# Altium schematic sheet ADS131A04.SchDoc
size A4; SheetNumber: 3; SheetTotal: 3
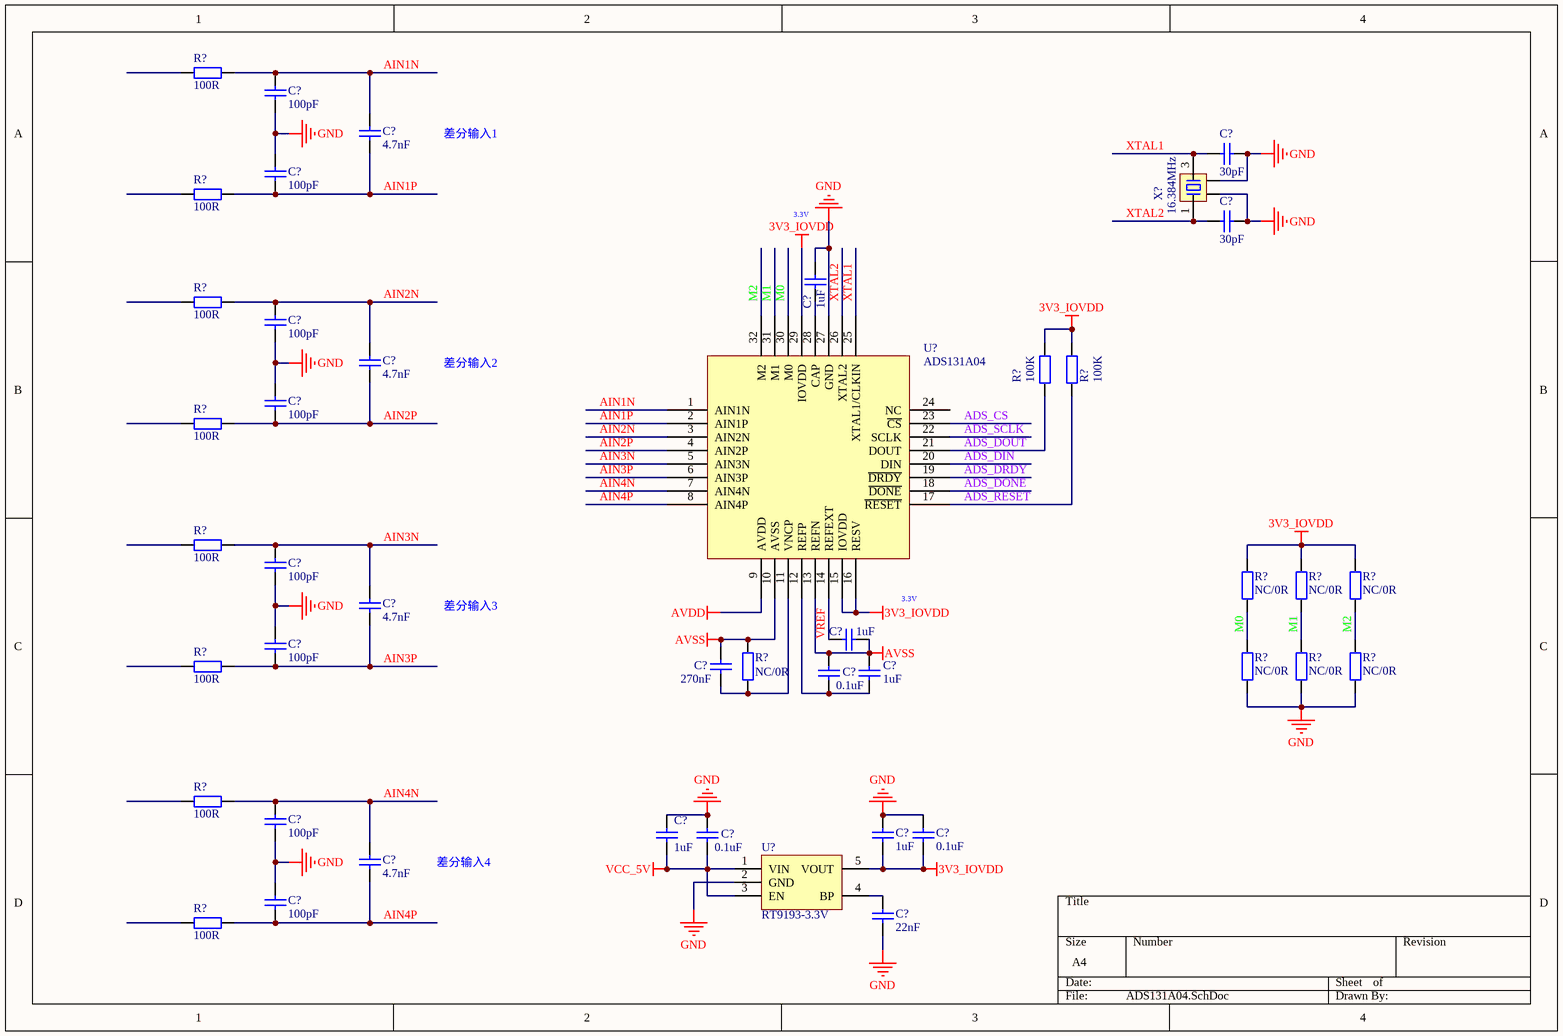
[diagram p0: ADS131A04.SchDoc]

## Parts
(Parts that share a designator on the sheet are numbered #1, #2 ... from top to bottom, then left to right.)
C?#1  100pF  [C0402_L]
C?#2  4.7nF  [C0603_L]
C?#3  30pF  [C0402_L]
C?#4  100pF  [C0402_L]
C?#5  30pF  [C0402_L]
C?#6  1uF  [C0402_L]
C?#7  100pF  [C0402_L]
C?#8  4.7nF  [C0603_L]
C?#9  100pF  [C0402_L]
C?#10  100pF  [C0402_L]
C?#11  4.7nF  [C0603_L]
C?#12  1uF  [C0402_L]
C?#13  100pF  [C0402_L]
C?#14  270nF  [C0402_L]
C?#15  0.1uF  [C0402_L]
C?#16  1uF  [C0402_L]
C?#17  100pF  [C0402_L]
C?#18  1uF  [C0402_L]
C?#19  0.1uF  [C0402_L]
C?#20  1uF  [C0402_L]
C?#21  0.1uF  [C0402_L]
C?#22  4.7nF  [C0603_L]
C?#23  100pF  [C0402_L]
C?#24  22nF  [C0402_L]
R?#1  100R  [R0402_L]
R?#2  100R  [R0402_L]
R?#3  100R  [R0402_L]
R?#4  100K  [R0402_L]
R?#5  100K  [R0402_L]
R?#6  100R  [R0402_L]
R?#7  100R  [R0402_L]
R?#8  NC/0R  [R0402_L]
R?#9  NC/0R  [R0402_L]
R?#10  NC/0R  [R0402_L]
R?#11  100R  [R0402_L]
R?#12  NC/0R  [R0402_L]
R?#13  NC/0R  [R0402_L]
R?#14  NC/0R  [R0402_L]
R?#15  NC/0R  [R0402_L]
R?#16  100R  [R0402_L]
R?#17  100R  [R0402_L]
U?#1  ADS131A04  [TQFP32 5x5_L]
U?#2  RT9193-3.3V  [SOT23-5L]
X?  16.384MHz  [XTAL-3225-4P]

## Nets
3V3_IOVDD: C?#20.1 C?#21.1 R?#4.2 R?#5.2 R?#8.2 R?#9.2 R?#10.2 U?#1.15(IOVDD) U?#1.16(RESV) U?#1.29(IOVDD) U?#2.5(VOUT)
AVDD: U?#1.9(AVDD)
AVSS: C?#12.2 C?#14.2 C?#15.2 C?#16.2 R?#12.2 U?#1.10(AVSS) U?#1.13(REFN)
GND: C?#1.1 C?#3.2 C?#4.2 C?#5.2 C?#6.2 C?#7.1 C?#9.2 C?#10.1 C?#13.2 C?#17.1 C?#18.2 C?#19.2 C?#20.2 C?#21.2 C?#23.2 C?#24.1 R?#13.1 R?#14.1 R?#15.1 U?#1.27(GND) U?#2.2(GND) X?.2 X?.4
VCC_5V: C?#18.1 C?#19.1 U?#2.1(VIN) U?#2.3(EN)
ADS_CS: U?#1.23(~{CS})
ADS_DIN: U?#1.20(DIN)
ADS_DONE: U?#1.18(~{DONE})
ADS_DOUT: R?#4.1 U?#1.21(DOUT)
ADS_DRDY: U?#1.19(~{DRDY})
ADS_RESET: R?#5.1 U?#1.17(~{RESET})
ADS_SCLK: U?#1.22(SCLK)
AIN1N: C?#1.2 C?#2.2 R?#1.2 U?#1.1(AIN1N)
AIN1P: C?#2.1 C?#4.1 R?#2.2 U?#1.2(AIN1P)
AIN2N: C?#7.2 C?#8.2 R?#3.2 U?#1.3(AIN2N)
AIN2P: C?#8.1 C?#9.1 R?#6.2 U?#1.4(AIN2P)
AIN3N: C?#10.2 C?#11.2 R?#7.2 U?#1.5(AIN3N)
AIN3P: C?#11.1 C?#13.1 R?#11.2 U?#1.6(AIN3P)
AIN4N: C?#17.2 C?#22.2 R?#16.2 U?#1.7(AIN4N)
AIN4P: C?#22.1 C?#23.1 R?#17.2 U?#1.8(AIN4P)
M0: R?#8.1 R?#13.2 U?#1.30(M0)
M1: R?#9.1 R?#14.2 U?#1.31(M1)
M2: R?#10.1 R?#15.2 U?#1.32(M2)
VREF: C?#12.1 U?#1.14(REFEXT)
XTAL1: C?#3.1 U?#1.25(XTAL1/CLKIN) X?.3
XTAL2: C?#5.1 U?#1.26(XTAL2) X?.1
NetC?#6_1: C?#6.1 U?#1.28(CAP)
NetC?#14_1: C?#14.1 R?#12.1 U?#1.11(VNCP)
NetC?#15_1: C?#15.1 C?#16.1 U?#1.12(REFP)
NetC?#24_2: C?#24.2 U?#2.4(BP)

Not connected (* = marked no-connect by the designer): R?#1 1; R?#2 1; R?#3 1; R?#6 1; R?#7 1; R?#11 1; R?#16 1; R?#17 1; U?#1 24(NC)

## Notes on the sheet
- 差分输入1
- 3.3V
- 差分输入2
- 差分输入3
- (near U?#1) 3.3V
- 差分输入4

## Library data of the parts
C?#1-C?#24 = C: 贴片电容; BOM名称: 无极性贴片电容; 联系卖家，免费查找封装: 唯一出售店铺网址https://shop463601444.taobao.com
R?#1-R?#17 = R: 贴片电阻; 联系卖家，免费查找封装: 唯一出售店铺网址https://shop463601444.taobao.com; BOM名称: 贴片电阻
U?#1 = ADS131A04: 4通道差分24位ADC
U?#2 = RT9193-3.3V: 3.3V_LDO
X? = XTAL-4P: 4脚无源晶振(谐振器）; 联系卖家，免费查找封装: 唯一出售店铺网址https://shop463601444.taobao.com; BOM名称: 4脚无源晶振(谐振器）